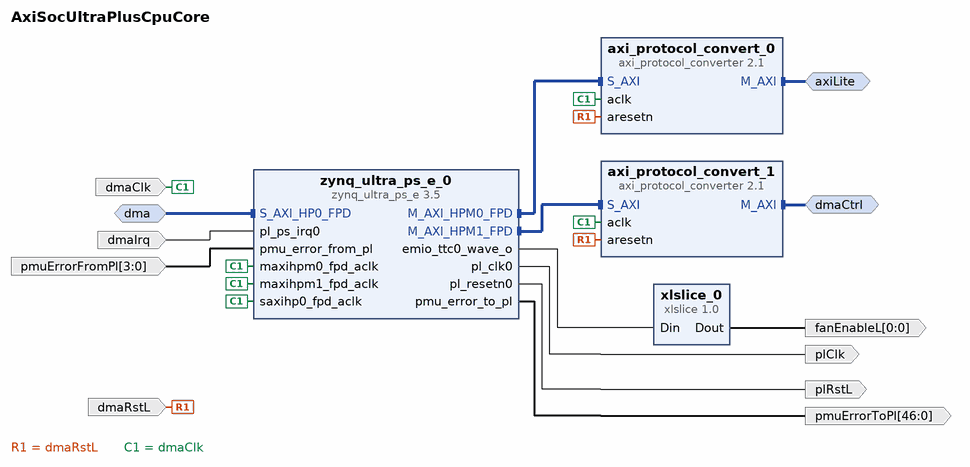
[diagram p0: block diagram of the top level]
# Vivado block design AxiSocUltraPlusCpuCore, xczu47dr-ffve1156-1-e, Vivado 2023.1
create_bd_design AxiSocUltraPlusCpuCore

create_bd_intf_port -mode Master -vlnv xilinx.com:interface:aximm_rtl:1.0 axiLite
set_property -dict [list \
  CONFIG.ADDR_WIDTH 40 \
  CONFIG.DATA_WIDTH 32 \
  CONFIG.FREQ_HZ 250000000 \
  CONFIG.HAS_BURST 0 \
  CONFIG.HAS_CACHE 0 \
  CONFIG.HAS_LOCK 0 \
  CONFIG.HAS_QOS 0 \
  CONFIG.HAS_REGION 0 \
  CONFIG.PROTOCOL AXI4LITE \
] [get_bd_intf_ports axiLite]
create_bd_intf_port -mode Slave -vlnv xilinx.com:interface:aximm_rtl:1.0 dma
set_property -dict [list \
  CONFIG.ADDR_WIDTH 49 \
  CONFIG.ARUSER_WIDTH 1 \
  CONFIG.AWUSER_WIDTH 1 \
  CONFIG.BUSER_WIDTH 0 \
  CONFIG.DATA_WIDTH 128 \
  CONFIG.FREQ_HZ 250000000 \
  CONFIG.HAS_BRESP 1 \
  CONFIG.HAS_BURST 1 \
  CONFIG.HAS_CACHE 1 \
  CONFIG.HAS_LOCK 1 \
  CONFIG.HAS_PROT 1 \
  CONFIG.HAS_QOS 1 \
  CONFIG.HAS_REGION 0 \
  CONFIG.HAS_RRESP 1 \
  CONFIG.HAS_WSTRB 1 \
  CONFIG.ID_WIDTH 6 \
  CONFIG.MAX_BURST_LENGTH 256 \
  CONFIG.NUM_READ_OUTSTANDING 16 \
  CONFIG.NUM_READ_THREADS 1 \
  CONFIG.NUM_WRITE_OUTSTANDING 16 \
  CONFIG.NUM_WRITE_THREADS 1 \
  CONFIG.PROTOCOL AXI4 \
  CONFIG.READ_WRITE_MODE READ_WRITE \
  CONFIG.RUSER_BITS_PER_BYTE 0 \
  CONFIG.RUSER_WIDTH 0 \
  CONFIG.SUPPORTS_NARROW_BURST 1 \
  CONFIG.WUSER_BITS_PER_BYTE 0 \
  CONFIG.WUSER_WIDTH 0 \
] [get_bd_intf_ports dma]
create_bd_intf_port -mode Master -vlnv xilinx.com:interface:aximm_rtl:1.0 dmaCtrl
set_property -dict [list \
  CONFIG.ADDR_WIDTH 40 \
  CONFIG.DATA_WIDTH 32 \
  CONFIG.FREQ_HZ 250000000 \
  CONFIG.HAS_BURST 0 \
  CONFIG.HAS_CACHE 0 \
  CONFIG.HAS_LOCK 0 \
  CONFIG.HAS_QOS 0 \
  CONFIG.HAS_REGION 0 \
  CONFIG.PROTOCOL AXI4LITE \
] [get_bd_intf_ports dmaCtrl]
create_bd_port -dir I -type clk dmaClk
set_property -dict [list \
  CONFIG.ASSOCIATED_BUSIF dma:axiLite:dmaCtrl \
  CONFIG.ASSOCIATED_RESET dmaRstL \
  CONFIG.FREQ_HZ 250000000 \
] [get_bd_ports dmaClk]
create_bd_port -dir I -type intr dmaIrq
create_bd_port -dir I -type rst dmaRstL
create_bd_port -dir O -from 0 -to 0 fanEnableL
create_bd_port -dir O -type clk plClk
set_property -dict {CONFIG.ASSOCIATED_RESET plRstL CONFIG.FREQ_HZ 249999985} [get_bd_ports plClk]
create_bd_port -dir O -type rst plRstL
create_bd_port -dir I -from 3 -to 0 pmuErrorFromPl
create_bd_port -dir O -from 46 -to 0 pmuErrorToPl

create_bd_cell -type ip -vlnv xilinx.com:ip:axi_protocol_converter:2.1 axi_protocol_convert_0
set_property -dict [list \
  CONFIG.ADDR_WIDTH 40 \
  CONFIG.DATA_WIDTH 32 \
  CONFIG.MI_PROTOCOL AXI4LITE \
  CONFIG.READ_WRITE_MODE READ_WRITE \
  CONFIG.SI_PROTOCOL AXI4 \
] [get_bd_cells axi_protocol_convert_0]
create_bd_cell -type ip -vlnv xilinx.com:ip:axi_protocol_converter:2.1 axi_protocol_convert_1
set_property -dict [list \
  CONFIG.ADDR_WIDTH 40 \
  CONFIG.DATA_WIDTH 32 \
  CONFIG.MI_PROTOCOL AXI4LITE \
  CONFIG.READ_WRITE_MODE READ_WRITE \
  CONFIG.SI_PROTOCOL AXI4 \
] [get_bd_cells axi_protocol_convert_1]
create_bd_cell -type ip -vlnv xilinx.com:ip:xlslice:1.0 xlslice_0
set_property -dict {CONFIG.DIN_FROM 2 CONFIG.DIN_TO 2 CONFIG.DIN_WIDTH 3 CONFIG.DOUT_WIDTH 1} [get_bd_cells xlslice_0]
create_bd_cell -type ip -vlnv xilinx.com:ip:zynq_ultra_ps_e:3.5 zynq_ultra_ps_e_0
set_property -dict [list \
  CONFIG.PSU_BANK_0_IO_STANDARD LVCMOS18 \
  CONFIG.PSU_BANK_1_IO_STANDARD LVCMOS18 \
  CONFIG.PSU_BANK_2_IO_STANDARD LVCMOS18 \
  CONFIG.PSU_BANK_3_IO_STANDARD LVCMOS18 \
  CONFIG.PSU_USB3__DUAL_CLOCK_ENABLE 1 \
  CONFIG.PSU__CRF_APB__DDR_CTRL__FREQMHZ 1200 \
  CONFIG.PSU__CRL_APB__PL0_REF_CTRL__FREQMHZ 250 \
  CONFIG.PSU__CSUPMU__PERIPHERAL__VALID 1 \
  CONFIG.PSU__DDRC__DEVICE_CAPACITY {8192 MBits} \
  CONFIG.PSU__DDRC__DRAM_WIDTH {16 Bits} \
  CONFIG.PSU__DDRC__SPEED_BIN DDR4_2400P \
  CONFIG.PSU__DDR_HIGH_ADDRESS_GUI_ENABLE 1 \
  CONFIG.PSU__DDR__INTERFACE__FREQMHZ 600.000 \
  CONFIG.PSU__DLL__ISUSED 1 \
  CONFIG.PSU__ENET3__FIFO__ENABLE 0 \
  CONFIG.PSU__ENET3__GRP_MDIO__ENABLE 1 \
  CONFIG.PSU__ENET3__GRP_MDIO__IO {MIO 76 .. 77} \
  CONFIG.PSU__ENET3__PERIPHERAL__ENABLE 1 \
  CONFIG.PSU__ENET3__PERIPHERAL__IO {MIO 64 .. 75} \
  CONFIG.PSU__ENET3__PTP__ENABLE 0 \
  CONFIG.PSU__ENET3__TSU__ENABLE 0 \
  CONFIG.PSU__GEM3_COHERENCY 0 \
  CONFIG.PSU__GEM3_ROUTE_THROUGH_FPD 0 \
  CONFIG.PSU__GEM__TSU__ENABLE 0 \
  CONFIG.PSU__GPIO0_MIO__IO {MIO 0 .. 25} \
  CONFIG.PSU__GPIO0_MIO__PERIPHERAL__ENABLE 1 \
  CONFIG.PSU__GPIO1_MIO__IO {MIO 26 .. 51} \
  CONFIG.PSU__GPIO1_MIO__PERIPHERAL__ENABLE 1 \
  CONFIG.PSU__GPIO2_MIO__IO {MIO 52 .. 77} \
  CONFIG.PSU__GPIO2_MIO__PERIPHERAL__ENABLE 1 \
  CONFIG.PSU__I2C0__PERIPHERAL__ENABLE 1 \
  CONFIG.PSU__I2C0__PERIPHERAL__IO {MIO 14 .. 15} \
  CONFIG.PSU__I2C1__PERIPHERAL__ENABLE 1 \
  CONFIG.PSU__I2C1__PERIPHERAL__IO {MIO 32 .. 33} \
  CONFIG.PSU__MAXIGP0__DATA_WIDTH 32 \
  CONFIG.PSU__MAXIGP1__DATA_WIDTH 32 \
  CONFIG.PSU__PCIE__CLASS_CODE_BASE 0x05 \
  CONFIG.PSU__PCIE__CLASS_CODE_INTERFACE 0x0 \
  CONFIG.PSU__PCIE__CLASS_CODE_SUB 0x80 \
  CONFIG.PSU__PCIE__DEVICE_ID 0xD011 \
  CONFIG.PSU__PCIE__INTX_GENERATION 1 \
  CONFIG.PSU__PCIE__INTX_PIN INTA \
  CONFIG.PSU__PCIE__REVISION_ID 0x0 \
  CONFIG.PSU__PCIE__SUBSYSTEM_ID 0x7 \
  CONFIG.PSU__PCIE__SUBSYSTEM_VENDOR_ID 0x10EE \
  CONFIG.PSU__PCIE__VENDOR_ID 0x10EE \
  CONFIG.PSU__PMU_COHERENCY 0 \
  CONFIG.PSU__PMU__AIBACK__ENABLE 0 \
  CONFIG.PSU__PMU__EMIO_GPI__ENABLE 0 \
  CONFIG.PSU__PMU__EMIO_GPO__ENABLE 0 \
  CONFIG.PSU__PMU__GPI0__ENABLE 0 \
  CONFIG.PSU__PMU__GPI1__ENABLE 0 \
  CONFIG.PSU__PMU__GPI2__ENABLE 0 \
  CONFIG.PSU__PMU__GPI3__ENABLE 0 \
  CONFIG.PSU__PMU__GPI4__ENABLE 0 \
  CONFIG.PSU__PMU__GPI5__ENABLE 0 \
  CONFIG.PSU__PMU__GPO0__ENABLE 0 \
  CONFIG.PSU__PMU__GPO1__ENABLE 0 \
  CONFIG.PSU__PMU__GPO2__ENABLE 0 \
  CONFIG.PSU__PMU__GPO3__ENABLE 0 \
  CONFIG.PSU__PMU__GPO4__ENABLE 0 \
  CONFIG.PSU__PMU__GPO5__ENABLE 0 \
  CONFIG.PSU__PMU__PERIPHERAL__ENABLE 1 \
  CONFIG.PSU__PMU__PLERROR__ENABLE 1 \
  CONFIG.PSU__PRESET_APPLIED 1 \
  CONFIG.PSU__PSS_REF_CLK__FREQMHZ 33.333333 \
  CONFIG.PSU__QSPI_COHERENCY 0 \
  CONFIG.PSU__QSPI_ROUTE_THROUGH_FPD 0 \
  CONFIG.PSU__QSPI__GRP_FBCLK__ENABLE 1 \
  CONFIG.PSU__QSPI__GRP_FBCLK__IO {MIO 6} \
  CONFIG.PSU__QSPI__PERIPHERAL__DATA_MODE x4 \
  CONFIG.PSU__QSPI__PERIPHERAL__ENABLE 1 \
  CONFIG.PSU__QSPI__PERIPHERAL__IO {MIO 0 .. 12} \
  CONFIG.PSU__QSPI__PERIPHERAL__MODE {Dual Parallel} \
  CONFIG.PSU__SD1_COHERENCY 0 \
  CONFIG.PSU__SD1_ROUTE_THROUGH_FPD 0 \
  CONFIG.PSU__SD1__CLK_50_SDR_ITAP_DLY 0x15 \
  CONFIG.PSU__SD1__CLK_50_SDR_OTAP_DLY 0x5 \
  CONFIG.PSU__SD1__DATA_TRANSFER_MODE 4Bit \
  CONFIG.PSU__SD1__GRP_CD__ENABLE 0 \
  CONFIG.PSU__SD1__GRP_POW__ENABLE 0 \
  CONFIG.PSU__SD1__GRP_WP__ENABLE 0 \
  CONFIG.PSU__SD1__PERIPHERAL__ENABLE 1 \
  CONFIG.PSU__SD1__PERIPHERAL__IO {MIO 46 .. 51} \
  CONFIG.PSU__SD1__SLOT_TYPE {SD 2.0} \
  CONFIG.PSU__SWDT0__CLOCK__ENABLE 0 \
  CONFIG.PSU__SWDT0__PERIPHERAL__ENABLE 1 \
  CONFIG.PSU__SWDT0__RESET__ENABLE 0 \
  CONFIG.PSU__SWDT1__CLOCK__ENABLE 0 \
  CONFIG.PSU__SWDT1__PERIPHERAL__ENABLE 1 \
  CONFIG.PSU__SWDT1__RESET__ENABLE 0 \
  CONFIG.PSU__TSU__BUFG_PORT_PAIR 0 \
  CONFIG.PSU__TTC0__CLOCK__ENABLE 0 \
  CONFIG.PSU__TTC0__PERIPHERAL__ENABLE 1 \
  CONFIG.PSU__TTC0__WAVEOUT__ENABLE 1 \
  CONFIG.PSU__TTC0__WAVEOUT__IO EMIO \
  CONFIG.PSU__TTC1__CLOCK__ENABLE 0 \
  CONFIG.PSU__TTC1__PERIPHERAL__ENABLE 1 \
  CONFIG.PSU__TTC1__WAVEOUT__ENABLE 0 \
  CONFIG.PSU__TTC2__CLOCK__ENABLE 0 \
  CONFIG.PSU__TTC2__PERIPHERAL__ENABLE 1 \
  CONFIG.PSU__TTC2__WAVEOUT__ENABLE 0 \
  CONFIG.PSU__TTC3__CLOCK__ENABLE 0 \
  CONFIG.PSU__TTC3__PERIPHERAL__ENABLE 1 \
  CONFIG.PSU__TTC3__WAVEOUT__ENABLE 0 \
  CONFIG.PSU__UART0__BAUD_RATE 115200 \
  CONFIG.PSU__UART0__MODEM__ENABLE 0 \
  CONFIG.PSU__UART0__PERIPHERAL__ENABLE 1 \
  CONFIG.PSU__UART0__PERIPHERAL__IO {MIO 42 .. 43} \
  CONFIG.PSU__USB0_COHERENCY 0 \
  CONFIG.PSU__USB0__PERIPHERAL__ENABLE 1 \
  CONFIG.PSU__USB0__PERIPHERAL__IO {MIO 52 .. 63} \
  CONFIG.PSU__USB2_0__EMIO__ENABLE 0 \
  CONFIG.PSU__USB3_0__PERIPHERAL__ENABLE 0 \
  CONFIG.PSU__USB__RESET__MODE {Boot Pin} \
  CONFIG.PSU__USB__RESET__POLARITY {Active Low} \
  CONFIG.PSU__USE__IRQ0 1 \
  CONFIG.PSU__USE__M_AXI_GP0 1 \
  CONFIG.PSU__USE__M_AXI_GP1 1 \
  CONFIG.PSU__USE__M_AXI_GP2 0 \
  CONFIG.PSU__USE__S_AXI_GP2 1 \
  CONFIG.SUBPRESET1 Custom \
] [get_bd_cells zynq_ultra_ps_e_0]
# 105 more settings of zynq_ultra_ps_e_0 are not shown: defaults, MIO pin electricals, DDR timing, and values the tool derives

# ---- connections ----

connect_bd_intf_net -intf_net S_AXI_HP0_FPD_0_1 [get_bd_intf_ports dma] [get_bd_intf_pins zynq_ultra_ps_e_0/S_AXI_HP0_FPD]
connect_bd_intf_net [get_bd_intf_ports axiLite] [get_bd_intf_pins axi_protocol_convert_0/M_AXI]
connect_bd_intf_net [get_bd_intf_ports dmaCtrl] [get_bd_intf_pins axi_protocol_convert_1/M_AXI]
connect_bd_intf_net [get_bd_intf_pins axi_protocol_convert_0/S_AXI] [get_bd_intf_pins zynq_ultra_ps_e_0/M_AXI_HPM0_FPD]
connect_bd_intf_net [get_bd_intf_pins axi_protocol_convert_1/S_AXI] [get_bd_intf_pins zynq_ultra_ps_e_0/M_AXI_HPM1_FPD]
connect_bd_net -net aresetn_0_1 [get_bd_ports dmaRstL] [get_bd_pins axi_protocol_convert_0/aresetn] [get_bd_pins axi_protocol_convert_1/aresetn]
connect_bd_net [get_bd_ports dmaIrq] [get_bd_pins zynq_ultra_ps_e_0/pl_ps_irq0]
connect_bd_net -net maxihpm0_fpd_aclk_0_1 [get_bd_ports dmaClk] \
  [get_bd_pins axi_protocol_convert_0/aclk] [get_bd_pins axi_protocol_convert_1/aclk] \
  [get_bd_pins zynq_ultra_ps_e_0/maxihpm0_fpd_aclk] [get_bd_pins zynq_ultra_ps_e_0/maxihpm1_fpd_aclk] \
  [get_bd_pins zynq_ultra_ps_e_0/saxihp0_fpd_aclk]
connect_bd_net [get_bd_ports pmuErrorFromPl] [get_bd_pins zynq_ultra_ps_e_0/pmu_error_from_pl]
connect_bd_net [get_bd_pins xlslice_0/Dout] [get_bd_ports fanEnableL]
connect_bd_net [get_bd_pins zynq_ultra_ps_e_0/emio_ttc0_wave_o] [get_bd_pins xlslice_0/Din]
connect_bd_net [get_bd_pins zynq_ultra_ps_e_0/pl_clk0] [get_bd_ports plClk]
connect_bd_net [get_bd_pins zynq_ultra_ps_e_0/pl_resetn0] [get_bd_ports plRstL]
connect_bd_net [get_bd_pins zynq_ultra_ps_e_0/pmu_error_to_pl] [get_bd_ports pmuErrorToPl]

# ---- address map ----
assign_bd_address -offset 0x0000000000000 -range 2G -target_address_space [get_bd_addr_spaces dma] [get_bd_addr_segs zynq_ultra_ps_e_0/SAXIGP2/HP0_DDR_LOW]
assign_bd_address -offset 0x00000C0000000 -range 512M -target_address_space [get_bd_addr_spaces dma] [get_bd_addr_segs zynq_ultra_ps_e_0/SAXIGP2/HP0_QSPI]
assign_bd_address -offset 0x00000FF000000 -range 16M -target_address_space [get_bd_addr_spaces dma] [get_bd_addr_segs zynq_ultra_ps_e_0/SAXIGP2/HP0_LPS_OCM]
assign_bd_address -offset 0x0000800000000 -range 32G -target_address_space [get_bd_addr_spaces dma] [get_bd_addr_segs zynq_ultra_ps_e_0/SAXIGP2/HP0_DDR_HIGH]
assign_bd_address -offset 0x00B0000000 -range 64K -target_address_space [get_bd_addr_spaces zynq_ultra_ps_e_0/Data] [get_bd_addr_segs dmaCtrl/Reg]
assign_bd_address -offset 0x0400000000 -range 4G -target_address_space [get_bd_addr_spaces zynq_ultra_ps_e_0/Data] [get_bd_addr_segs axiLite/Reg]

validate_bd_design
save_bd_design
